# EAGLE design nitinolDriver (EAGLE 7.5.0)
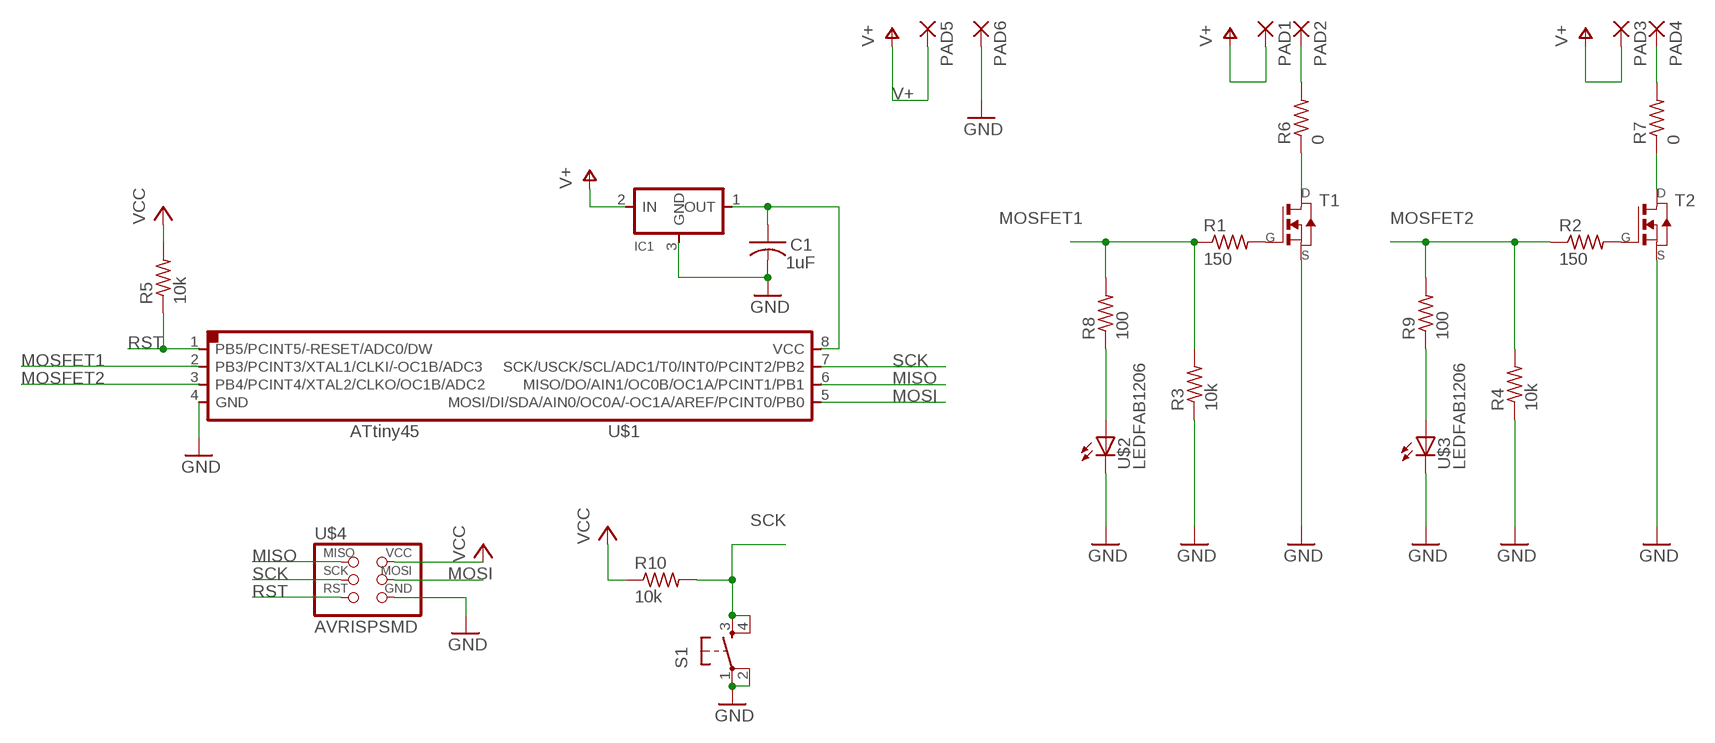
[diagram p0: schematic, sheet 1]

## Parts
C1  1uF  CAP-US1206FAB  [C1206FAB]
IC1  REGULATORSOT23  [SOT23]
PAD1  2,15/1,0  [2,15/1,0]
PAD2  2,15/1,0  [2,15/1,0]
PAD3  2,15/1,0  [2,15/1,0]
PAD4  2,15/1,0  [2,15/1,0]
PAD5  2,15/1,0  [2,15/1,0]
PAD6  2,15/1,0  [2,15/1,0]
R1  150  RES-US1206FAB  [R1206FAB]
R2  150  RES-US1206FAB  [R1206FAB]
R3  10k  RES-US1206FAB  [R1206FAB]
R4  10k  RES-US1206FAB  [R1206FAB]
R5  10k  RES-US1206FAB  [R1206FAB]
R6  0  RES-US1206FAB  [R1206FAB]
R7  0  RES-US1206FAB  [R1206FAB]
R8  100  RES-US1206FAB  [R1206FAB]
R9  100  RES-US1206FAB  [R1206FAB]
R10  10k  RES-US1206FAB  [R1206FAB]
S1  6MM_SWITCH6MM_SWITCH  [6MM_SWITCH]
T1  NMOSFETSOT23  [SOT-23]
T2  NMOSFETSOT23  [SOT-23]
U$1  ATTINY45SI  [SOIC8]
U$2  LEDFAB1206  [LED1206FAB]
U$3  LEDFAB1206  [LED1206FAB]
U$4  AVRISPSMD  [2X03SMD]

## Nets
GND: C1.2 IC1.3(GND) PAD6.1(P) R3.1 R4.1 S1.1(P) S1.2(P1) T1.2(S) T2.2(S) U$1.4(GND) U$2.2(C) U$3.2(C) U$4.6(GND)
MISO: U$1.6(MISO/DO/AIN1/OC0B/OC1A/PCINT1/PB1) U$4.1(MISO)
MOSFET1: R1.1 R3.2 R8.2 U$1.2(PB3/PCINT3/XTAL1/CLKI/-OC1B/ADC3)
MOSFET2: R2.1 R4.2 R9.2 U$1.3(PB4/PCINT4/XTAL2/CLKO/OC1B/ADC2)
MOSI: U$1.5(MOSI/DI/SDA/AIN0/OC0A/-OC1A/AREF/PCINT0/PB0) U$4.4(MOSI)
N$1: R1.2 T1.3(G)
N$2: R2.2 T2.3(G)
N$3: R8.1 U$2.1(A)
N$4: R9.1 U$3.1(A)
N$5: PAD4.1(P) R7.2
N$8: PAD2.1(P) R6.2
N$11: R7.1 T2.1(D)
N$14: R6.1 T1.1(D)
RST: R5.1 U$1.1(PB5/PCINT5/-RESET/ADC0/DW) U$4.5(RST)
SCK: R10.2 S1.3(S) S1.4(S1) U$1.7(SCK/USCK/SCL/ADC1/T0/INT0/PCINT2/PB2) U$4.3(SCK)
V+: IC1.2(IN) PAD1.1(P) PAD3.1(P) PAD5.1(P)
VCC: C1.1 IC1.1(OUT) R5.2 R10.1 U$1.8(VCC) U$4.2(VCC)

## Library data of the parts
C1 = fab:CAP-US
IC1 = fab:REGULATOR
PAD1-PAD6 = wirepad:2,15/1,0: THROUGH-HOLE PAD
R1-R10 = fab:RES-US: Resistor (US Symbol) Variants with postfix FAB are widened to allow the routing of internal traces
S1 = fab:6MM_SWITCH: OMRON SWITCH
T1 T2 = fab:NMOSFET: MOS FET
U$1 = fab:ATTINY45
U$2 U$3 = fab:LED: LED
U$4 = fab:AVRISP

## Board
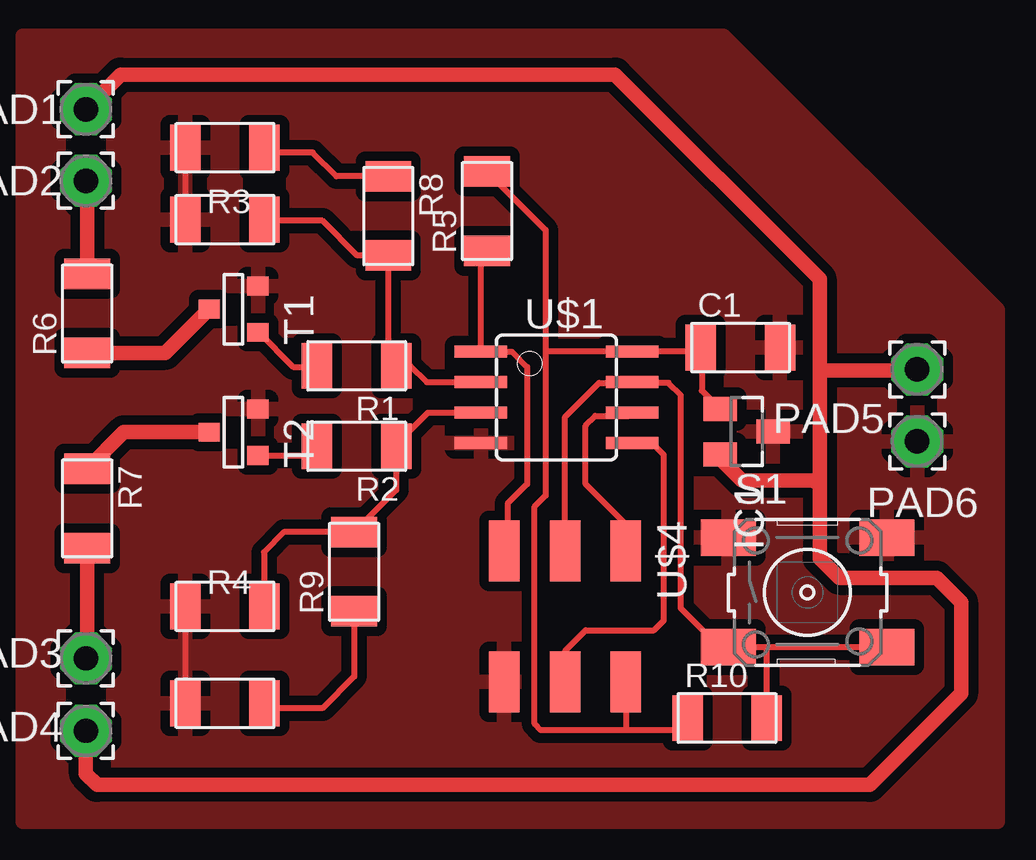
[diagram p1: board, top side]

No outline drawn. Coordinates in mm, seen from the top.
Copper layers 1: Top 0.035mm
Design rules "default *": minimum track width 10mil, minimum drill 24mil, track to track 16mil, track to pad 16mil, pad to pad 16mil, via to via 16mil, smd to smd 16mil, copper to edge 1mil, drill to drill 8mil, minimum pad ring 10mil, minimum via ring 8mil, stop-mask expansion 4mil, vias tented up to drill 0mil, thermal gap 16mil

### Footprints (pad centres in the part's own frame; a part is rotated, then mirrored left to right if it is on the bottom)
C1206FAB = smd 1.27 x 1.905: 1 -1.651,0; 2 1.651,0
SOT23 = smd 1 x 1.4: 1 -0.95,-1.1; 2 0.95,-1.1; 3 0,1.1
2,15/1,0 = drill 1.016 pad 2.159 octagon: 1 0,0
R1206FAB = smd 1.27 x 1.905: 1 -1.651,0; 2 1.651,0
6MM_SWITCH = smd 2.286 x 1.524: 1 -3.302,2.286; 2 3.302,2.286; 3 -3.302,-2.286; 4 3.302,-2.286
SOT-23 = smd 0.787 x 0.889: 1 0.025,-1.016; 2 -0.94,1.016; 3 0.991,1.016
SOIC8 = smd 0.5 x 2.2: 1 -1.905,-3.154; 2 -0.645,-3.154; 3 0.625,-3.154; 4 1.895,-3.154; 5 1.905,3.154; 6 0.635,3.154; 7 -0.635,3.154; 8 -1.905,3.154
LED1206FAB = smd 1.27 x 1.905: 1 -1.651,0; 2 1.651,0
2X03SMD = smd 2.54 x 1.27: 1 -2.54,2.54; 2 2.92,2.54; 3 -2.54,0; 4 2.92,0; 5 -2.54,-2.54; 6 2.92,-2.54

### Placement (x,y rotation side)
C1  30.43,25.6 0 top
IC1  30.68,22.1 270 top
PAD1  3.14,35.54 0 top
PAD2  3.14,32.56 0 top
PAD3  3.14,9.62 0 top
PAD4  3.14,12.64 0 top
PAD5  37.8,24.69 0 top
PAD6  37.8,21.69 0 top
R1  14.43,24.84 180 top
R2  14.43,21.49 180 top
R3  8.94,30.94 0 top
R4  8.94,14.81 0 top
R5  19.86,31.29 90 top
R6  3.2,27.03 90 top
R7  3.2,18.9 270 top
R8  15.75,31.09 270 top
R9  14.33,16.26 90 top
R10  29.87,10.16 0 top
S1  33.22,15.39 0 top
T1  9.3,27.23 270 top
T2  9.3,22.1 270 top
U$1  22.76,23.52 270 top
U$2  8.94,33.93 180 top
U$3  8.94,10.77 180 top
U$4  23.11,14.58 270 top

### Tracks (layer width: path | path; a pad name or v marks a point on that pad's centre or on a via)
GND
  Top 0.254: U$2.2 R3.1 | T1.2 10.06,28.17 | R4.1 U$3.2
  pour Top: 0.51,5.84 41.15,5.84 41.15,26.92 41.15,27.18 29.72,38.61 0.51,38.61
MISO
  Top 0.254: U$4.1 25.65,18.24 23.98,19.91 23.98,22.35 24.38,22.76 25.79,22.76 U$1.6
MOSFET1
  Top 0.254: U$1.2 19.59,24.16 17.35,24.16 16.66,24.84 R1.1 15.75,25.17 R8.2 14.45,29.44 13.01,30.89 10.64,30.89 R3.2
MOSFET2
  Top 0.254: U$1.3 19.59,22.89 17.4,22.89 16.08,21.57 R2.1 16.08,19.66 R9.2 11.4,17.91 10.57,17.07 10.57,14.83 R4.2
MOSI
  Top 0.254: U$4.4 23.11,12.95 23.98,13.82 26.82,13.82 27.23,14.22 27.23,21.13 26.82,21.54 25.99,21.54 U$1.5
N$1
  Top 0.254: T1.3 10.34,26.24 11.79,24.79 12.72,24.79 R1.2
N$2
  Top 0.254: T2.3 12.39,21.11 R2.2
N$3
  Top 0.254: R8.1 13.59,32.74 12.6,33.73 10.79,33.73 U$2.1
N$4
  Top 0.254: R9.1 14.33,11.89 13.01,10.57 10.79,10.57 U$3.1
N$5
  Top 0.61: PAD4.1 3.2,12.7 R7.2
N$8
  Top 0.61: PAD2.1 3.2,32.56 R6.2
N$11
  Top 0.61: R7.1 4.72,22.07 T2.1
N$14
  Top 0.61: R6.1 6.45,25.38 T1.1
RST
  Top 0.254: U$4.5 20.73,17.27 20.73,19.1 21.54,19.91 21.54,24.79 20.9,25.43 U$1.1 19.6,29.38 R5.1
SCK
  Top 0.254: U$4.3 23.11,22.71 24.54,24.13 25.89,24.13 U$1.7 25.94,24.13 27.43,24.13 27.94,23.62 27.94,14.73 29.57,13.11 S1.3 31.55,13.11 | S1.4 31.55,13.11 | R10.2 31.52,13.08 31.55,13.11
V+
  Top 0.61: PAD3.1 3.14,7.83 3.61,7.37 35.81,7.37 39.62,11.18 39.62,14.99 38.61,16 34.54,16 33.73,16.82 33.73,19.81 | PAD1.1 4.59,36.98 25.2,36.98 33.73,28.45 33.73,24.64 | PAD5.1 37.74,24.64 33.73,24.64 | 33.73,24.64 33.73,20.07 | 33.67,20.12 33.73,20.07 | 33.73,20.07 33.73,19.81 | IC1.2 29.58,20.96 30.48,20.07 33.48,20.07 33.73,19.81
VCC
  Top 0.254: R5.2 22.3,30.5 22.3,25.43 | 22.3,25.43 22.3,19.43 21.84,18.97 21.84,9.91 22.1,9.65 25.65,9.65 | C1.1 28.6,25.43 | 28.6,25.43 U$1.8 22.3,25.43 | 28.6,25.43 28.82,25.2 28.82,23.81 IC1.1 | R10.1 27.96,9.65 25.65,9.65 | U$4.2 25.65,9.65